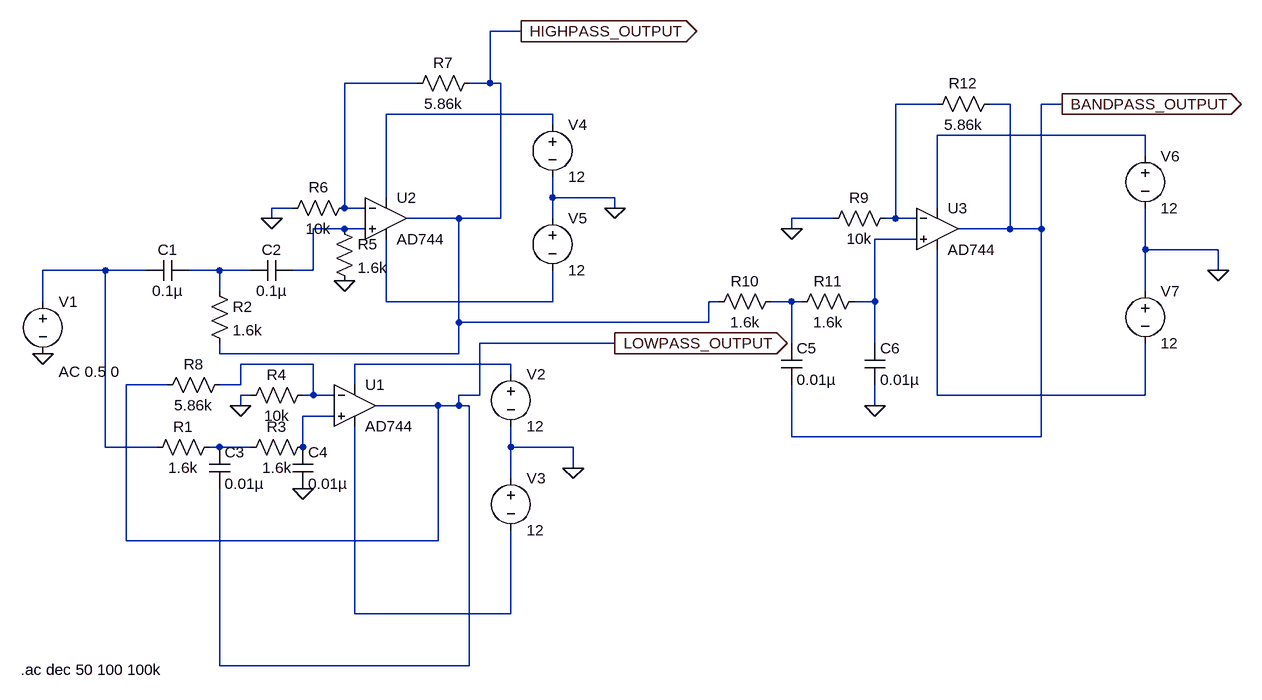
[diagram p0: schematic universal_filter.asc]
universal_filter.asc, the LTspice schematic file:
Version 4
SHEET 1 1880 680
WIRE 752 -320 704 -320
WIRE 592 -240 480 -240
WIRE 704 -240 704 -320
WIRE 704 -240 672 -240
WIRE 720 -240 704 -240
WIRE 1392 -208 1328 -208
WIRE 1504 -208 1472 -208
WIRE 1584 -208 1552 -208
WIRE 800 -192 544 -192
WIRE 800 -176 800 -192
WIRE 1712 -160 1392 -160
WIRE 1712 -128 1712 -160
WIRE 544 -64 544 -192
WIRE 800 -64 800 -96
WIRE 896 -64 800 -64
WIRE 400 -48 368 -48
WIRE 480 -48 480 -240
WIRE 512 -48 480 -48
WIRE 896 -48 896 -64
WIRE 1392 -48 1392 -160
WIRE 368 -32 368 -48
WIRE 656 -32 576 -32
WIRE 720 -32 720 -240
WIRE 720 -32 656 -32
WIRE 800 -32 800 -64
WIRE 1232 -32 1168 -32
WIRE 1328 -32 1328 -208
WIRE 1328 -32 1312 -32
WIRE 1360 -32 1328 -32
WIRE 480 -16 432 -16
WIRE 512 -16 480 -16
WIRE 1168 -16 1168 -32
WIRE 1504 -16 1504 -208
WIRE 1504 -16 1424 -16
WIRE 1552 -16 1552 -208
WIRE 1552 -16 1504 -16
WIRE 1360 0 1296 0
WIRE 1712 16 1712 -48
WIRE 1824 16 1712 16
WIRE 112 48 16 48
WIRE 176 48 112 48
WIRE 288 48 240 48
WIRE 336 48 288 48
WIRE 432 48 432 -16
WIRE 432 48 400 48
WIRE 1824 48 1824 16
WIRE 288 80 288 48
WIRE 1712 80 1712 16
WIRE 16 96 16 48
WIRE 544 96 544 0
WIRE 800 96 800 48
WIRE 800 96 544 96
WIRE 1056 96 1040 96
WIRE 1168 96 1136 96
WIRE 1184 96 1168 96
WIRE 1296 96 1296 0
WIRE 1296 96 1264 96
WIRE 656 128 656 -32
WIRE 1040 128 1040 96
WIRE 1040 128 656 128
WIRE 896 160 688 160
WIRE 1168 160 1168 96
WIRE 1296 160 1296 96
WIRE 288 176 288 160
WIRE 656 176 656 128
WIRE 656 176 288 176
WIRE 432 192 320 192
WIRE 736 192 496 192
WIRE 736 208 736 192
WIRE 208 224 144 224
WIRE 320 224 320 192
WIRE 320 224 288 224
WIRE 496 224 496 192
WIRE 336 240 320 240
WIRE 432 240 432 192
WIRE 432 240 416 240
WIRE 464 240 432 240
WIRE 688 240 688 160
WIRE 688 240 656 240
WIRE 1392 240 1392 16
WIRE 1712 240 1712 160
WIRE 1712 240 1392 240
WIRE 320 256 320 240
WIRE 624 256 528 256
WIRE 656 256 656 240
WIRE 656 256 624 256
WIRE 672 256 656 256
WIRE 1296 256 1296 224
WIRE 464 272 416 272
WIRE 1168 304 1168 224
WIRE 1552 304 1552 -16
WIRE 1552 304 1168 304
WIRE 112 320 112 48
WIRE 192 320 112 320
WIRE 288 320 272 320
WIRE 336 320 288 320
WIRE 416 320 416 272
WIRE 736 320 736 288
WIRE 832 320 736 320
WIRE 832 352 832 320
WIRE 736 368 736 320
WIRE 144 464 144 224
WIRE 624 464 624 256
WIRE 624 464 144 464
WIRE 496 576 496 288
WIRE 736 576 736 448
WIRE 736 576 496 576
WIRE 288 656 288 384
WIRE 672 656 672 256
WIRE 672 656 288 656
FLAG 16 176 0
FLAG 416 384 0
FLAG 320 256 0
FLAG 480 64 0
FLAG 368 -32 0
FLAG 896 -48 0
FLAG 832 352 0
FLAG 896 160 LOWPASS_OUTPUT
IOPIN 896 160 Out
FLAG 752 -320 HIGHPASS_OUTPUT
IOPIN 752 -320 Out
FLAG 1824 48 0
FLAG 1168 -16 0
FLAG 1296 256 0
FLAG 1584 -208 BANDPASS_OUTPUT
IOPIN 1584 -208 Out
SYMBOL voltage 16 80 R0
WINDOW 123 24 124 Left 2
WINDOW 39 0 0 Left 0
SYMATTR InstName V1
SYMATTR Value ""
SYMATTR Value2 AC 0.5 0
SYMBOL cap 240 32 R90
WINDOW 0 0 32 VBottom 2
WINDOW 3 32 32 VTop 2
SYMATTR InstName C1
SYMATTR Value 0.1µ
SYMBOL cap 400 32 R90
WINDOW 0 0 32 VBottom 2
WINDOW 3 32 32 VTop 2
SYMATTR InstName C2
SYMATTR Value 0.1µ
SYMBOL res 272 64 R0
SYMATTR InstName R2
SYMATTR Value 1.6k
SYMBOL res 288 304 R90
WINDOW 0 0 56 VBottom 2
WINDOW 3 32 56 VTop 2
SYMATTR InstName R1
SYMATTR Value 1.6k
SYMBOL res 432 304 R90
WINDOW 0 0 56 VBottom 2
WINDOW 3 32 56 VTop 2
SYMATTR InstName R3
SYMATTR Value 1.6k
SYMBOL cap 272 320 R0
SYMATTR InstName C3
SYMATTR Value 0.01µ
SYMBOL cap 400 320 R0
SYMATTR InstName C4
SYMATTR Value 0.01µ
SYMBOL OpAmps\\AD744 496 192 R0
SYMATTR InstName U1
SYMBOL OpAmps\\AD744 544 -96 R0
SYMATTR InstName U2
SYMBOL res 432 224 R90
WINDOW 0 0 56 VBottom 2
WINDOW 3 32 56 VTop 2
SYMATTR InstName R4
SYMATTR Value 10k
SYMBOL res 464 -32 R0
SYMATTR InstName R5
SYMATTR Value 1.6k
SYMBOL res 496 -64 R90
WINDOW 0 0 56 VBottom 2
WINDOW 3 32 56 VTop 2
SYMATTR InstName R6
SYMATTR Value 10k
SYMBOL voltage 736 192 R0
SYMATTR InstName V2
SYMATTR Value 12
SYMBOL voltage 736 352 R0
WINDOW 123 0 0 Left 0
WINDOW 39 0 0 Left 0
SYMATTR InstName V3
SYMATTR Value 12
SYMBOL voltage 800 -192 R0
SYMATTR InstName V4
SYMATTR Value 12
SYMBOL voltage 800 -48 R0
SYMATTR InstName V5
SYMATTR Value 12
SYMBOL voltage 1712 -144 R0
SYMATTR InstName V6
SYMATTR Value 12
SYMBOL voltage 1712 64 R0
SYMATTR InstName V7
SYMATTR Value 12
SYMBOL OpAmps\\AD744 1392 -80 R0
SYMATTR InstName U3
SYMBOL res 688 -256 R90
WINDOW 0 0 56 VBottom 2
WINDOW 3 32 56 VTop 2
SYMATTR InstName R7
SYMATTR Value 5.86k
SYMBOL res 304 208 R90
WINDOW 0 0 56 VBottom 2
WINDOW 3 32 56 VTop 2
SYMATTR InstName R8
SYMATTR Value 5.86k
SYMBOL res 1328 -48 R90
WINDOW 0 0 56 VBottom 2
WINDOW 3 32 56 VTop 2
SYMATTR InstName R9
SYMATTR Value 10k
SYMBOL res 1152 80 R90
WINDOW 0 0 56 VBottom 2
WINDOW 3 32 56 VTop 2
SYMATTR InstName R10
SYMATTR Value 1.6k
SYMBOL res 1280 80 R90
WINDOW 0 0 56 VBottom 2
WINDOW 3 32 56 VTop 2
SYMATTR InstName R11
SYMATTR Value 1.6k
SYMBOL cap 1152 160 R0
SYMATTR InstName C5
SYMATTR Value 0.01µ
SYMBOL cap 1280 160 R0
SYMATTR InstName C6
SYMATTR Value 0.01µ
SYMBOL res 1488 -224 R90
WINDOW 0 0 56 VBottom 2
WINDOW 3 32 56 VTop 2
SYMATTR InstName R12
SYMATTR Value 5.86k
TEXT -18 662 Left 2 !.ac dec 50 100 100k

The netlist it stands for:
* universal_filter.asc
V1 N007 0 AC 0.5 0
C1 N008 N007 0.1µ
C2 N005 N008 0.1µ
R2 N008 HIGHPASS_OUTPUT 1.6k
R1 N015 N007 1.6k
R3 N014 N015 1.6k
C3 N015 LOWPASS_OUTPUT 0.01µ
C4 N014 0 0.01µ
XU1 N014 N011 N012 N016 LOWPASS_OUTPUT AD744  ; pins In+ In- V+ V- OUT
XU2 N005 N001 N003 N009 HIGHPASS_OUTPUT AD744  ; pins In+ In- V+ V- OUT
R4 N011 0 10k
R5 N005 0 1.6k
R6 N001 0 10k
V2 N012 0 12
V3 0 N016 12
V4 N003 0 12
V5 0 N009 12
V6 N004 0 12
V7 0 N013 12
XU3 N006 N002 N004 N013 BANDPASS_OUTPUT AD744  ; pins In+ In- V+ V- OUT
R7 HIGHPASS_OUTPUT N001 5.86k
R8 N011 LOWPASS_OUTPUT 5.86k
R9 N002 0 10k
R10 N010 HIGHPASS_OUTPUT 1.6k
R11 N006 N010 1.6k
C5 N010 BANDPASS_OUTPUT 0.01µ
C6 N006 0 0.01µ
R12 BANDPASS_OUTPUT N002 5.86k
.ac dec 50 100 100k
.backanno
.end